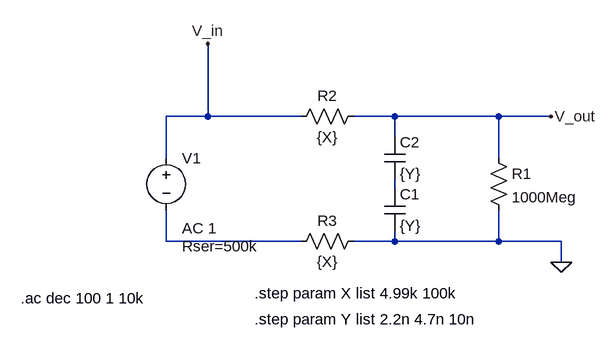
[diagram p0: schematic Filter_RC_Suggested.asc]
Filter_RC_Suggested.asc, the LTspice schematic file:
Version 4
SHEET 1 880 680
WIRE -768 -64 -768 -176
WIRE -768 -64 -832 -64
WIRE -624 -64 -768 -64
WIRE -480 -64 -544 -64
WIRE -320 -64 -480 -64
WIRE -240 -64 -320 -64
WIRE -480 -32 -480 -64
WIRE -832 0 -832 -64
WIRE -320 0 -320 -64
WIRE -480 48 -480 32
WIRE -832 128 -832 80
WIRE -624 128 -832 128
WIRE -480 128 -480 112
WIRE -480 128 -544 128
WIRE -320 128 -320 80
WIRE -320 128 -480 128
WIRE -224 128 -320 128
WIRE -224 160 -224 128
FLAG -240 -64 V_out
FLAG -768 -176 V_in
FLAG -224 160 0
SYMBOL cap -496 48 R0
SYMATTR InstName C1
SYMATTR Value {Y}
SYMBOL res -336 -16 R0
SYMATTR InstName R1
SYMATTR Value 1000Meg
SYMBOL voltage -832 -16 R0
WINDOW 123 24 124 Left 2
WINDOW 39 24 152 Left 2
SYMATTR Value2 AC 1
SYMATTR SpiceLine Rser=500k
SYMATTR InstName V1
SYMATTR Value ""
SYMBOL res -528 -80 R90
WINDOW 0 0 56 VBottom 2
WINDOW 3 32 56 VTop 2
SYMATTR InstName R2
SYMATTR Value {X}
SYMBOL res -528 112 R90
WINDOW 0 0 56 VBottom 2
WINDOW 3 32 56 VTop 2
SYMATTR InstName R3
SYMATTR Value {X}
SYMBOL cap -496 -32 R0
SYMATTR InstName C2
SYMATTR Value {Y}
TEXT -1056 216 Left 2 !.ac dec 100 1 10k
TEXT -696 208 Left 2 !.step param X list 4.99k 100k
TEXT -696 248 Left 2 !.step param Y list 2.2n 4.7n 10n

The netlist it stands for:
* Filter_RC_Suggested.asc
C1 N001 0 {Y}
R1 V_out 0 1000Meg
V1 V_in N002 AC 1 Rser=500k
R2 V_out V_in {X}
R3 0 N002 {X}
C2 V_out N001 {Y}
.ac dec 100 1 10k
.step param X list 4.99k 100k
.step param Y list 2.2n 4.7n 10n
.backanno
.end